# EasyEDA Pro project compute-module-v101.eprj, schematic digital-input-module
Board Name: mod-digital-input-module; Create Date: 2025-10-22; Page Name: P1; Project Name: compute-module-v101; Schematic Name: digital-input-module; Update Date: 2025-11-28; Company: EasyEDA.com; Page Size: A4; Version: V1.0
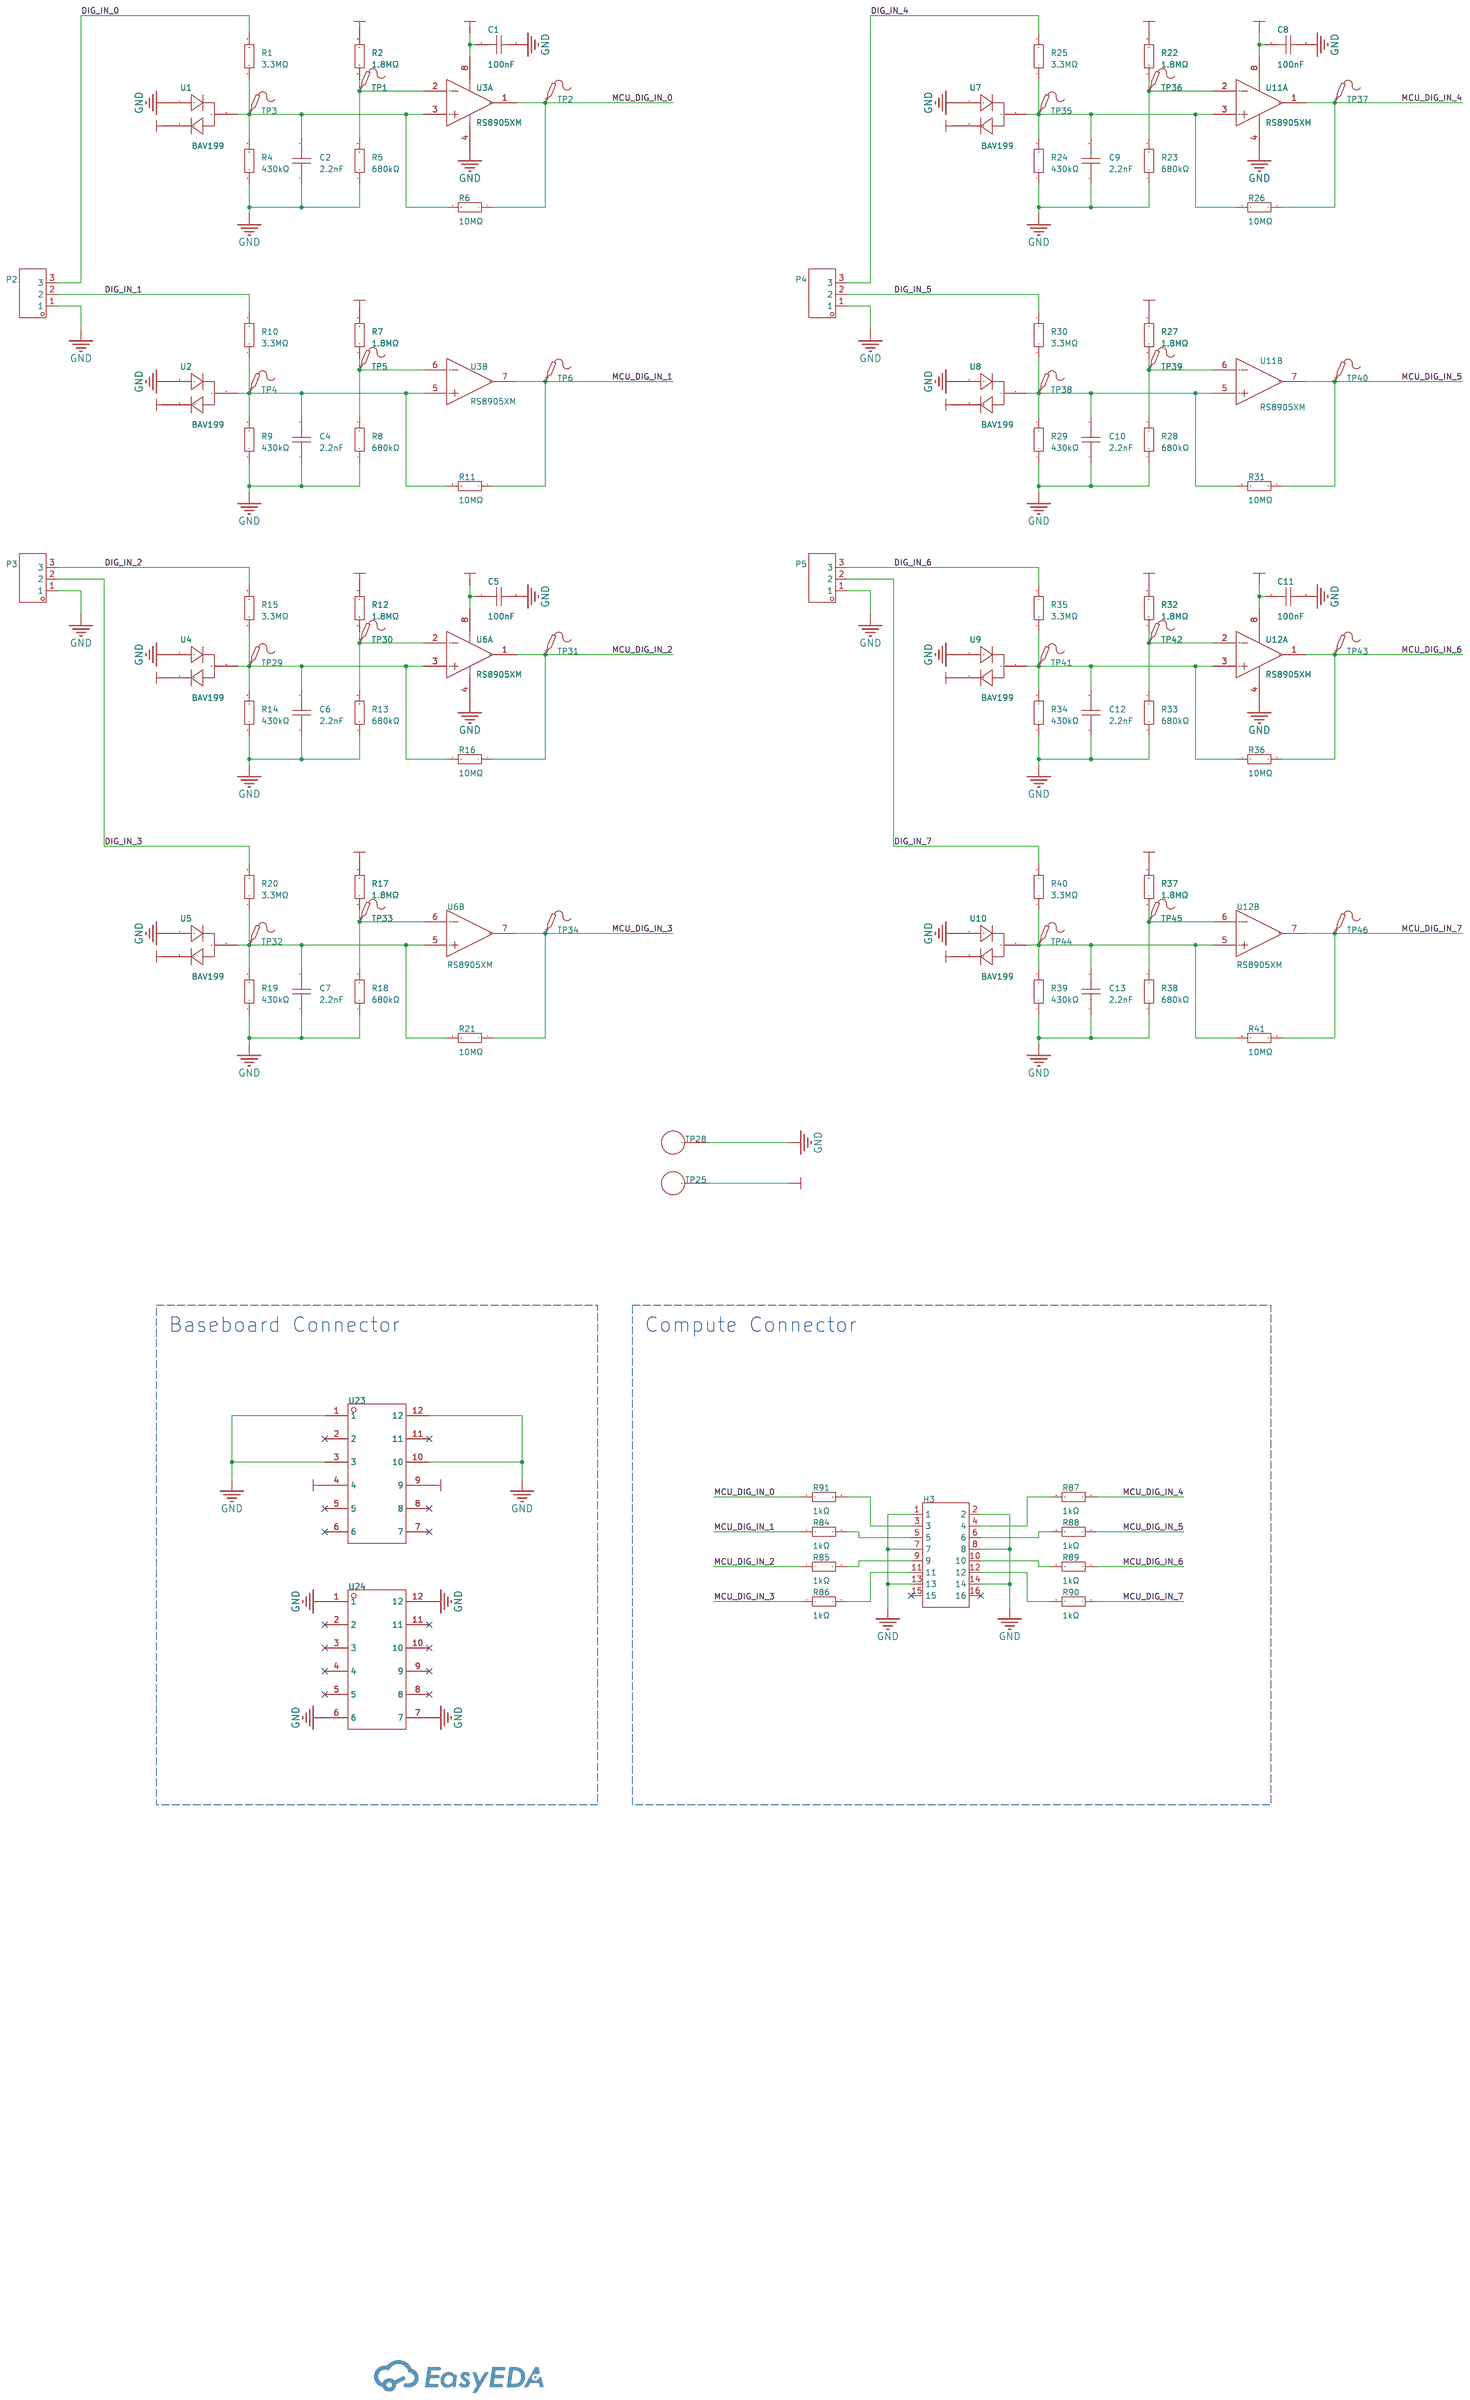
[diagram p3: schematic sheet]

## Parts
C1  100nF  [C0603]
C2  2.2nF  [C0603]
C4  2.2nF  [C0603]
C5  100nF  [C0603]
C6  2.2nF  [C0603]
C7  2.2nF  [C0603]
C8  100nF  [C0603]
C9  2.2nF  [C0603]
C10  2.2nF  [C0603]
C11  100nF  [C0603]
C12  2.2nF  [C0603]
C13  2.2nF  [C0603]
H3  XDZ200-2-08-S-2.0-G1  [HDR-SMD_16P-P2.00-V-M-R2-C8-LS6.5]
P2  WJ15EDGRC-3.81-3P  [CONN-TH_3P-P3.81_WJ15EDGRC-3.81-3P]
P3  WJ15EDGRC-3.81-3P  [CONN-TH_3P-P3.81_WJ15EDGRC-3.81-3P]
P4  WJ15EDGRC-3.81-3P  [CONN-TH_3P-P3.81_WJ15EDGRC-3.81-3P]
P5  WJ15EDGRC-3.81-3P  [CONN-TH_3P-P3.81_WJ15EDGRC-3.81-3P]
R1  3.3MΩ  [R0603]
R2  1.8MΩ  [R0603]
R4  430kΩ  [R0603]
R5  680kΩ  [R0603]
R6  10MΩ  [R0603]
R7  1.8MΩ  [R0603]
R8  680kΩ  [R0603]
R9  430kΩ  [R0603]
R10  3.3MΩ  [R0603]
R11  10MΩ  [R0603]
R12  1.8MΩ  [R0603]
R13  680kΩ  [R0603]
R14  430kΩ  [R0603]
R15  3.3MΩ  [R0603]
R16  10MΩ  [R0603]
R17  1.8MΩ  [R0603]
R18  680kΩ  [R0603]
R19  430kΩ  [R0603]
R20  3.3MΩ  [R0603]
R21  10MΩ  [R0603]
R22  1.8MΩ  [R0603]
R23  680kΩ  [R0603]
R24  430kΩ  [R0603]
R25  3.3MΩ  [R0603]
R26  10MΩ  [R0603]
R27  1.8MΩ  [R0603]
R28  680kΩ  [R0603]
R29  430kΩ  [R0603]
R30  3.3MΩ  [R0603]
R31  10MΩ  [R0603]
R32  1.8MΩ  [R0603]
R33  680kΩ  [R0603]
R34  430kΩ  [R0603]
R35  3.3MΩ  [R0603]
R36  10MΩ  [R0603]
R37  1.8MΩ  [R0603]
R38  680kΩ  [R0603]
R39  430kΩ  [R0603]
R40  3.3MΩ  [R0603]
R41  10MΩ  [R0603]
R84  1kΩ  [R0603]
R85  1kΩ  [R0603]
R86  1kΩ  [R0603]
R87  1kΩ  [R0603]
R88  1kΩ  [R0603]
R89  1kΩ  [R0603]
R90  1kΩ  [R0603]
R91  1kΩ  [R0603]
TP1  -  [Test-Point-0.5mm]
TP2  -  [Test-Point-0.5mm]
TP3  -  [Test-Point-0.5mm]
TP4  -  [Test-Point-0.5mm]
TP5  -  [Test-Point-0.5mm]
TP6  -  [Test-Point-0.5mm]
TP25  RH-5004  [TESTPOINT_TH_BD2.5-D1.2]
TP28  RH-5004  [TESTPOINT_TH_BD2.5-D1.2]
TP29  -  [Test-Point-0.5mm]
TP30  -  [Test-Point-0.5mm]
TP31  -  [Test-Point-0.5mm]
TP32  -  [Test-Point-0.5mm]
TP33  -  [Test-Point-0.5mm]
TP34  -  [Test-Point-0.5mm]
TP35  -  [Test-Point-0.5mm]
TP36  -  [Test-Point-0.5mm]
TP37  -  [Test-Point-0.5mm]
TP38  -  [Test-Point-0.5mm]
TP39  -  [Test-Point-0.5mm]
TP40  -  [Test-Point-0.5mm]
TP41  -  [Test-Point-0.5mm]
TP42  -  [Test-Point-0.5mm]
TP43  -  [Test-Point-0.5mm]
TP44  -  [Test-Point-0.5mm]
TP45  -  [Test-Point-0.5mm]
TP46  -  [Test-Point-0.5mm]
U1  BAV199  [SOT-23-3_L2.9-W1.3-P0.95-LS2.4-BR]
U2  BAV199  [SOT-23-3_L2.9-W1.3-P0.95-LS2.4-BR]
U3  RS8905XM  [MSOP-8_L3.0-W3.0-P0.65-LS4.9-BL]  (sections 1,2)
U4  BAV199  [SOT-23-3_L2.9-W1.3-P0.95-LS2.4-BR]
U5  BAV199  [SOT-23-3_L2.9-W1.3-P0.95-LS2.4-BR]
U6  RS8905XM  [MSOP-8_L3.0-W3.0-P0.65-LS4.9-BL]  (sections 1,2)
U7  BAV199  [SOT-23-3_L2.9-W1.3-P0.95-LS2.4-BR]
U8  BAV199  [SOT-23-3_L2.9-W1.3-P0.95-LS2.4-BR]
U9  BAV199  [SOT-23-3_L2.9-W1.3-P0.95-LS2.4-BR]
U10  BAV199  [SOT-23-3_L2.9-W1.3-P0.95-LS2.4-BR]
U11  RS8905XM  [MSOP-8_L3.0-W3.0-P0.65-LS4.9-BL]  (sections 1,2)
U12  RS8905XM  [MSOP-8_L3.0-W3.0-P0.65-LS4.9-BL]  (sections 1,2)
U23  -  [ED12BGFBK-CARD]
U24  -  [ED12BGFBK-CARD]

## Library data of the parts
C1 C5 C8 C11 = CC0603KRX7R9BB104: Capacitance:100nF Tolerance:±10% Tolerance:±10% Voltage Rating:50V Temperature Coefficient:X7R; LCSC Part Name: 100nF ±10% 50V; Supplier Part: C14663; Manufacturer: YAGEO(国巨); Supplier Footprint: 0603; JLCPCB Part Class: Basic Part; Datasheet: https://item.szlcsc.com/datasheet/CC0603KRX7R9BB104/15331.html; Supplier: LCSC; Tolerance: ±10%; Voltage Rating: 50V; Temperature Coefficient: X7R
C2 C4 C6 C7 C9 C10 C12 C13 = 0603B222K500NT: Capacitance:2.2nF Tolerance:±10% Tolerance:±10% Voltage Rating:50V Temperature Coefficient:X7R; LCSC Part Name: 2.2nF ±10% 50V; Supplier Part: C1604; Manufacturer: FH(风华); Supplier Footprint: 0603; JLCPCB Part Class: Basic Part; Datasheet: https://item.szlcsc.com/datasheet/0603B222K500NT/1956.html; Supplier: LCSC; Tolerance: ±10%; Voltage Rating: 50V; Temperature Coefficient: X7R
H3 = XDZ200-2-08-S-2.0-G1: LCSC Part Name: 2x8P 间距:2mm 方针 立贴; Supplier Part: C19268811; Manufacturer: XUNDA(讯答); Supplier Footprint: SMD,P=2mm; JLCPCB Part Class: Extended Part; Datasheet: https://item.szlcsc.com/datasheet/XDZ200-2-08-S-2.0-G1/20528703.html; Supplier: LCSC; Pin Structure: 2x8P; Pitch: 2mm; Circluar Pins/Square Pins: Pin Header; Mounting Type: Surface Mount,Vertical; Number of Rows: 2; Number of Pins: 16P; Current Rating: 1.5A; Length of Mating Pin: 4mm; Insulation Height: 2mm; Operating Temperature: -40℃~+105℃; Color: Black
P2-P5 = WJ15EDGRC-3.81-3P: LCSC Part Name: 1x3P 3.81mm 排数:1 每排P数:3; Supplier Part: C8406; Manufacturer: KANGNEX(康奈克斯电气); Supplier Footprint: 弯插,P=3.81mm; JLCPCB Part Class: Extended Part; Datasheet: https://item.szlcsc.com/datasheet/WJ15EDGRC-3.81-3P/8900.html; Supplier: LCSC; Connector Type: Board Side/Socket - Closed; Number of Positions or Pins: 1x3P; Pitch: 3.81mm; Mounting Type: Right-Angle Pin; Number of Pins: 3P; Number of Rows: 1; Number of PINs Per Row: 3; Operating Temperature: -40℃~+105℃
R1 R10 R15 R20 R25 R30 R35 R40 = 0603WAF3304T5E: Type:Thick Film Resistor Resistance:3.3MΩ Tolerance:±1% Tolerance:±1% Power(Watts):100mW Voltage-Supply(Max):75V Temperature Coefficient:±100ppm/℃ Temperature Coefficient:±100ppm/℃ Operating Temperature:-55℃~+155℃ Operating Temperature:-55℃~+155℃; LCSC Part Name: 3.3MΩ ±1% 100mW 厚膜电阻; Supplier Part: C26096; Manufacturer: UNI-ROYAL(厚声); Supplier Footprint: 0603; JLCPCB Part Class: Extended Part; Datasheet: https://item.szlcsc.com/datasheet/0603WAF3304T5E/26839.html; Supplier: LCSC; Type: Thick Film Resistor; Tolerance: ±1%; Power(Watts): 100mW; Voltage-Supply(Max): 75V; Temperature Coefficient: ±100ppm/℃; Operating Temperature: -55℃~+155℃
R2 R7 R12 R17 R22 R27 R32 R37 = FRC0603F1804TS: Type:Thick Film Resistor Resistance:1.8MΩ Tolerance:±1% Tolerance:±1% Power(Watts):100mW Voltage-Supply(Max):75V Temperature Coefficient:±100ppm/℃ Temperature Coefficient:±100ppm/℃ Operating Temperature:-55℃~+155℃ Operating Temperature:-55℃~+155℃; LCSC Part Name: 1.8MΩ ±1% 100mW 厚膜电阻; Supplier Part: C2933162; Manufacturer: FOJAN(富捷); Supplier Footprint: 0603; JLCPCB Part Class: Extended Part; Supplier: LCSC; Type: Thick Film Resistor; Tolerance: ±1%; Power(Watts): 100mW; Voltage-Supply(Max): 75V; Temperature Coefficient: ±100ppm/℃; Operating Temperature: -55℃~+155℃
R4 R9 R14 R19 R24 R29 R34 R39 = 0603WAF4303T5E: Type:Thick Film Resistor Resistance:430kΩ Tolerance:±1% Tolerance:±1% Power(Watts):100mW Voltage-Supply(Max):75V Temperature Coefficient:±100ppm/℃ Temperature Coefficient:±100ppm/℃ Operating Temperature:-55℃~+155℃ Operating Temperature:-55℃~+155℃; LCSC Part Name: 430kΩ ±1% 100mW 厚膜电阻; Supplier Part: C25969; Manufacturer: UNI-ROYAL(厚声); Supplier Footprint: 0603; JLCPCB Part Class: Extended Part; Datasheet: https://item.szlcsc.com/datasheet/0603WAF4303T5E/26712.html; Supplier: LCSC; Type: Thick Film Resistor; Tolerance: ±1%; Power(Watts): 100mW; Voltage-Supply(Max): 75V; Temperature Coefficient: ±100ppm/℃; Operating Temperature: -55℃~+155℃
R5 R8 R13 R18 R23 R28 R33 R38 = 0603WAF6803T5E: Type:Thick Film Resistor Resistance:680kΩ Tolerance:±1% Tolerance:±1% Power(Watts):100mW Voltage-Supply(Max):75V Temperature Coefficient:±100ppm/℃ Temperature Coefficient:±100ppm/℃ Operating Temperature:-55℃~+155℃ Operating Temperature:-55℃~+155℃; LCSC Part Name: 680kΩ ±1% 100mW 厚膜电阻; Supplier Part: C25822; Manufacturer: UNI-ROYAL(厚声); Supplier Footprint: 0603; JLCPCB Part Class: Extended Part; Datasheet: https://item.szlcsc.com/datasheet/0603WAF6803T5E/26565.html; Supplier: LCSC; Type: Thick Film Resistor; Tolerance: ±1%; Power(Watts): 100mW; Voltage-Supply(Max): 75V; Temperature Coefficient: ±100ppm/℃; Operating Temperature: -55℃~+155℃
R6 R11 R16 R21 R26 R31 R36 R41 = 0603WAF1005T5E: Type:Thick Film Resistors Resistance:10MΩ Tolerance:±1% Tolerance:±1% Power(Watts): Overload Voltage (Max): Temperature Coefficient:±100ppm/℃ Temperature Coefficient:±100ppm/℃ Operating Temperature Range:-55℃~+155℃ Operating Temperature Range:-55℃~+155℃; LCSC Part Name: 10MΩ ±1% 100mW 厚膜电阻; Supplier Part: C7250; Manufacturer: UNI-ROYAL(厚声); Supplier Footprint: 0603; JLCPCB Part Class: Basic Part; Datasheet: https://atta.szlcsc.com/upload/public/pdf/source/20200306/C422600_1E6D84923E4A46A82E41ADD87F860B5C.pdf; Supplier: LCSC; Type: Thick Film Resistors; Tolerance: ±1%; Temperature Coefficient: ±100ppm/℃; Operating Temperature Range: -55℃~+155℃
R84-R91 = 0603WAF1001T5E: Type:Thick Film Resistors Resistance:1kΩ Tolerance:±1% Tolerance:±1% Power(Watts): Overload Voltage (Max): Temperature Coefficient:±100ppm/℃ Temperature Coefficient:±100ppm/℃ Operating Temperature Range:-55℃~+155℃ Operating Temperature Range:-55℃~+155℃; LCSC Part Name: 1kΩ ±1% 100mW 厚膜电阻; Supplier Part: C21190; Manufacturer: UNI-ROYAL(厚声); Supplier Footprint: 0603; JLCPCB Part Class: Basic Part; Datasheet: https://atta.szlcsc.com/upload/public/pdf/source/20200306/C422600_1E6D84923E4A46A82E41ADD87F860B5C.pdf; Supplier: LCSC; Type: Thick Film Resistors; Tolerance: ±1%; Temperature Coefficient: ±100ppm/℃; Operating Temperature Range: -55℃~+155℃
TP1-TP6 TP29-TP46 = Test-Point: Check: false
TP25 TP28 = RH-5004: Connector Type:Pin type (through board) Plastic Color:Yellow Board Space (Diameter φ/ Length x Width):2.5mm; LCSC Part Name: PCB电路板测试点/测试针; Supplier Part: C5199804; Manufacturer: 荣和; JLCPCB Part Class: Extended Part; Supplier: LCSC; Connector Type: Pin type (through board); Plastic Color: Yellow; Board Space (Diameter φ/ Length x Width): 2.5mm
U1 U2 U4 U5 U7-U10 = BAV199_C5184419: Supplier Part: C5184419; Manufacturer: HXY MOSFET(华轩阳电子); Supplier Footprint: SOT-23; JLCPCB Part Class: Extended Part; Datasheet: https://item.szlcsc.com/datasheet/BAV199/5849855.html; Supplier: LCSC; Diode Configuration: 1 Pair Series Connection; Voltage - Forward(Vf@If): 1.25V@150mA; Voltage - DC Reverse(Vr): 70V; Current - Rectified: 215mA; Pd - Power Dissipation: 200mW; Reverse Leakage Current (Ir): 5nA@75V; Reverse Recovery Time (trr): 3us; Operating Junction Temperature Range: -55℃~+150℃; Non-Repetitive Peak Forward Surge Current: 1A
U3 U6 U11 U12 = RS8905XM: LCSC Part Name: 微功耗比较器RS8905; Supplier Part: C5372656; Manufacturer: RUNIC(润石); Supplier Footprint: MSOP-8; JLCPCB Part Class: Extended Part; Datasheet: https://atta.szlcsc.com/upload/public/pdf/source/20230316/E9133064EE9D2ADCDC7D3DD82EE4887D.pdf; Supplier: LCSC; Number of Channels: 2; Vos - Input Offset Voltage: 3mV; Ib - Input Bias Current: 1pA; Propagation Delay Time: 9us; Output Type: TTL；CMOS; Rail to Rail: Rail-to-Rail Input, Rail-to-Rail Output; Quiescent Current: 400nA; Operating Temperature: -40℃~+125℃
U23 U24 = ED12BGFBK-CARD

## Nets
+3V3: C1.1 C5.1 C8.1 C11.1 R2.2 R7.2 R12.2 R17.2 R22.2 R27.2 R32.2 R37.2 TP25.1 U1.2 U2.2 U3.8(V+) U4.2 U5.2 U6.8(V+) U7.2 U8.2 U9.2 U10.2 U11.8(V+) U12.8(V+) U23.4 U23.9
GND: C1.2 C2.1 C4.1 C5.2 C6.1 C7.1 C8.2 C9.1 C10.1 C11.2 C12.1 C13.1 H3.1 H3.2 H3.7 H3.8 H3.13 H3.14 P2.1 P3.1 P4.1 P5.1 R4.1 R5.1 R8.1 R9.1 R13.1 R14.1 R18.1 R19.1 R23.1 R24.1 R28.1 R29.1 R33.1 R34.1 R38.1 R39.1 TP28.1 U1.1 U2.1 U3.4(V-) U4.1 U5.1 U6.4(V-) U7.1 U8.1 U9.1 U10.1 U11.4(V-) U12.4(V-) U23.1 U23.3 U23.10 U23.12 U24.1 U24.6 U24.7 U24.12
DIG_IN_0: P2.3 R1.2
DIG_IN_1: P2.2 R10.2
DIG_IN_2: P3.3 R15.2
DIG_IN_3: P3.2 R20.2
DIG_IN_4: P4.3 R25.2
DIG_IN_5: P4.2 R30.2
DIG_IN_6: P5.3 R35.2
DIG_IN_7: P5.2 R40.2
MCU_DIG_IN_0: R6.1 R91.1 TP2.1 U3.1(OUTA)
MCU_DIG_IN_1: R11.1 R84.1 TP6.1 U3.7(OUTB)
MCU_DIG_IN_2: R16.1 R85.1 TP31.1 U6.1(OUTA)
MCU_DIG_IN_3: R21.1 R86.1 TP34.1 U6.7(OUTB)
MCU_DIG_IN_4: R26.1 R87.1 TP37.1 U11.1(OUTA)
MCU_DIG_IN_5: R31.1 R88.1 TP40.1 U11.7(OUTB)
MCU_DIG_IN_6: R36.1 R89.1 TP43.1 U12.1(OUTA)
MCU_DIG_IN_7: R41.1 R90.1 TP46.1 U12.7(OUTB)
$1N594: R2.1 R5.2 TP1.1 U3.2(INA-)
$1N605: C2.2 R1.1 R4.2 R6.2 TP3.1 U1.3 U3.3(INA+)
$1N1512: R7.1 R8.2 TP5.1 U3.6(INB-)
$1N1525: C4.2 R9.2 R10.1 R11.2 TP4.1 U2.3 U3.5(INB+)
$1N5232: R17.1 R18.2 TP33.1 U6.6(INB-)
$1N5233: C7.2 R19.2 R20.1 R21.2 TP32.1 U5.3 U6.5(INB+)
$1N5242: R12.1 R13.2 TP30.1 U6.2(INA-)
$1N5244: C6.2 R14.2 R15.1 R16.2 TP29.1 U4.3 U6.3(INA+)
$1N7199: C10.2 R29.2 R30.1 R31.2 TP38.1 U8.3 U11.5(INB+)
$1N7200: R37.1 R38.2 TP45.1 U12.6(INB-)
$1N7201: C13.2 R39.2 R40.1 R41.2 TP44.1 U10.3 U12.5(INB+)
$1N7222: R32.1 R33.2 TP42.1 U12.2(INA-)
$1N7223: C12.2 R34.2 R35.1 R36.2 TP41.1 U9.3 U12.3(INA+)
$1N7253: R22.1 R23.2 TP36.1 U11.2(INA-)
$1N7260: C9.2 R24.2 R25.1 R26.2 TP35.1 U7.3 U11.3(INA+)
$1N7262: R27.1 R28.2 TP39.1 U11.6(INB-)
$1N10197: H3.3 R91.2
$1N10198: H3.5 R84.2
$1N10199: H3.9 R85.2
$1N10200: H3.11 R86.2
$1N10209: H3.4 R87.2
$1N10210: H3.6 R88.2
$1N10211: H3.10 R89.2
$1N10212: H3.12 R90.2

Not connected (* = marked no-connect by the designer): H3 15* 16*; U23 2* 5* 6* 7* 8* 11*; U24 2* 3* 4* 5* 8* 9* 10* 11*

## Notes on the sheet
- Baseboard Connector
- Compute Connector
